# EAGLE design DIL922SMD (EAGLE 6.2)
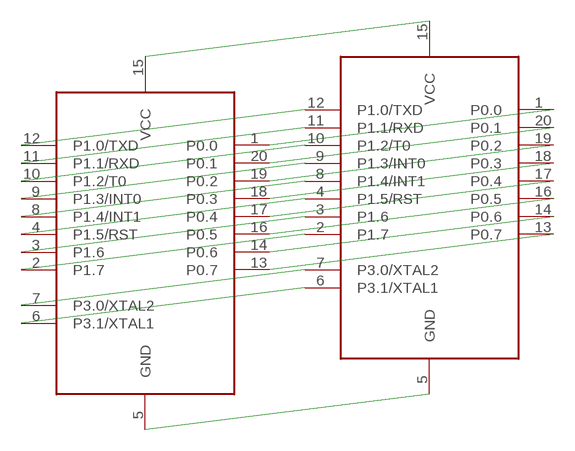
[diagram p0: schematic, sheet 1]

## Parts
89LPC922FN  89LPC922  [DIL20]
IC1  LPC922FDH  [TSSOP20]

## Nets
N$1: 89LPC922FN.5(GND) IC1.5(GND)
N$2: 89LPC922FN.1(P0.0) IC1.1(P0.0)
N$3: 89LPC922FN.20(P0.1) IC1.20(P0.1)
N$4: 89LPC922FN.19(P0.2) IC1.19(P0.2)
N$5: 89LPC922FN.18(P0.3) IC1.18(P0.3)
N$6: 89LPC922FN.17(P0.4) IC1.17(P0.4)
N$7: 89LPC922FN.16(P0.5) IC1.16(P0.5)
N$8: 89LPC922FN.14(P0.6) IC1.14(P0.6)
N$9: 89LPC922FN.13(P0.7) IC1.13(P0.7)
N$10: 89LPC922FN.12(P1.0/TXD) IC1.12(P1.0/TXD)
N$11: 89LPC922FN.11(P1.1/RXD) IC1.11(P1.1/RXD)
N$12: 89LPC922FN.10(P1.2/T0) IC1.10(P1.2/T0)
N$13: 89LPC922FN.9(P1.3/INT0) IC1.9(P1.3/INT0)
N$14: 89LPC922FN.8(P1.4/INT1) IC1.8(P1.4/INT1)
N$15: 89LPC922FN.4(P1.5/RST) IC1.4(P1.5/RST)
N$16: 89LPC922FN.3(P1.6) IC1.3(P1.6)
N$17: 89LPC922FN.2(P1.7) IC1.2(P1.7)
N$18: 89LPC922FN.7(P3.0/XTAL2) IC1.7(P3.0/XTAL2)
N$19: 89LPC922FN.6(P3.1/XTAL1) IC1.6(P3.1/XTAL1)
N$20: 89LPC922FN.15(VCC) IC1.15(VCC)

## Library data of the parts
89LPC922FN = micro-philips:89LPC922
IC1 = LPCGira:LPC922FDH

## Board
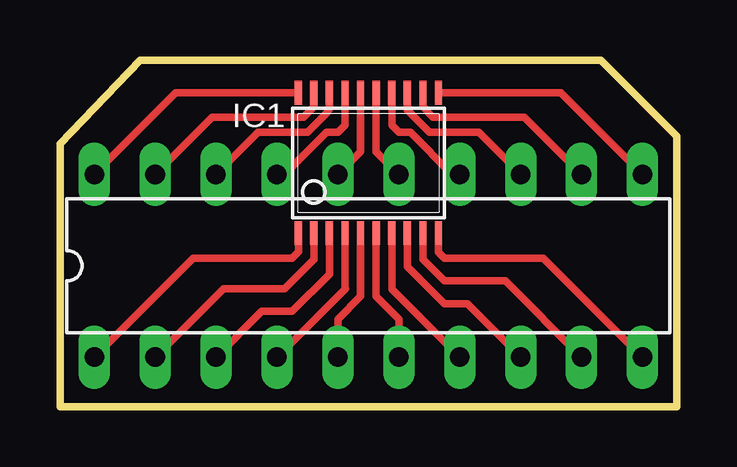
[diagram p1: board, top side]

Size 25.72 x 14.45 mm. Coordinates in mm from the lower left corner, seen from the top.
Outline: 0,0 0,10.95 3.33,14.45 22.54,14.45 25.72,11.27 25.72,0 0,0
Copper layers (1*16): Top 0.035mm / dielectric 1.5mm / Bottom 0.035mm
Design rules: minimum track width 10mil, minimum drill 24mil, track to track 8mil, track to pad 8mil, pad to pad 8mil, via to via 8mil, smd to smd 8mil, copper to edge 40mil, drill to drill 8mil, minimum pad ring 10mil, minimum via ring 8mil, stop-mask expansion 4mil, vias tented up to drill 0mil, thermal gap 10mil

### Footprints (pad centres in the part's own frame; a part is rotated, then mirrored left to right if it is on the bottom)
DIL20 = drill 0.813 long: 1 -11.43,-3.81; 2 -8.89,-3.81; 3 -6.35,-3.81; 4 -3.81,-3.81; 5 -1.27,-3.81; 6 1.27,-3.81; 7 3.81,-3.81; 8 6.35,-3.81; 9 8.89,-3.81; 10 11.43,-3.81; 11 11.43,3.81; 12 8.89,3.81; 13 6.35,3.81; 14 3.81,3.81; 15 1.27,3.81; 16 -1.27,3.81; 17 -3.81,3.81; 18 -6.35,3.81; 19 -8.89,3.81; 20 -11.43,3.81
TSSOP20 = smd 0.305 x 0.991: 1 -2.925,-2.918; 2 -2.275,-2.918; 3 -1.625,-2.918; 4 -0.975,-2.918; 5 -0.325,-2.918; 6 0.325,-2.918; 7 0.975,-2.918; 8 1.625,-2.918; 9 2.275,-2.918; 10 2.925,-2.918; 11 2.925,2.918; 12 2.275,2.918; 13 1.625,2.918; 14 0.975,2.918; 15 0.325,2.918; 16 -0.325,2.918; 17 -0.975,2.918; 18 -1.625,2.918; 19 -2.275,2.918; 20 -2.925,2.918

### Placement (x,y rotation side)
89LPC922FN  12.86,5.87 0 top
IC1  12.86,10.16 0 top

### Tracks (layer width: path | path; a pad name or v marks a point on that pad's centre or on a via)
N$1
  Top 0.305: IC1.5 12.53,4.6 11.59,3.65 89LPC922FN.5
N$2
  Top 0.305: IC1.1 9.94,6.45 9.68,6.19 5.56,6.19 89LPC922FN.1
N$3
  Top 0.305: IC1.20 4.82,13.08 89LPC922FN.20
N$4
  Top 0.305: IC1.19 10.58,12.49 10.16,12.06 6.35,12.06 89LPC922FN.19
N$5
  Top 0.305: IC1.18 11.23,12.42 11.11,12.22 10.32,11.43 8.25,11.43 89LPC922FN.18
N$6
  Top 0.305: IC1.17 11.88,11.72 11.59,11.43 11.11,11.43 9.37,9.68 89LPC922FN.17
N$7
  Top 0.305: IC1.16 12.53,10.63 89LPC922FN.16
N$8
  Top 0.305: IC1.14 13.83,11.72 14.13,11.43 14.6,11.43 16.35,9.68 89LPC922FN.14
N$9
  Top 0.305: IC1.13 14.48,12.35 15.4,11.43 17.46,11.43 89LPC922FN.13
N$10
  Top 0.305: IC1.12 15.13,12.49 15.56,12.06 19.37,12.06 89LPC922FN.12
N$11
  Top 0.305: IC1.11 20.89,13.08 89LPC922FN.11
N$12
  Top 0.305: IC1.10 15.78,6.44 16.03,6.19 20.16,6.19 89LPC922FN.10
N$13
  Top 0.305: IC1.9 15.13,6.14 16.03,5.24 18.57,5.24 89LPC922FN.9
N$14
  Top 0.305: IC1.8 14.48,5.84 16.03,4.29 16.99,4.29 89LPC922FN.8
N$15
  Top 0.305: IC1.4 11.88,4.9 | 11.88,4.9 11.91,4.92 | 11.88,4.9 89LPC922FN.4
N$16
  Top 0.305: IC1.3 11.23,5.52 9.68,3.97 8.41,3.97 89LPC922FN.3
N$17
  Top 0.305: IC1.2 10.58,6.14 9.37,4.92 6.83,4.92 89LPC922FN.2
N$18
  Top 0.305: IC1.7 13.83,4.9 89LPC922FN.7
N$19
  Top 0.305: IC1.6 13.18,4.6 14.13,3.65 89LPC922FN.6
N$20
  Top 0.305: IC1.15 13.18,10.63 89LPC922FN.15